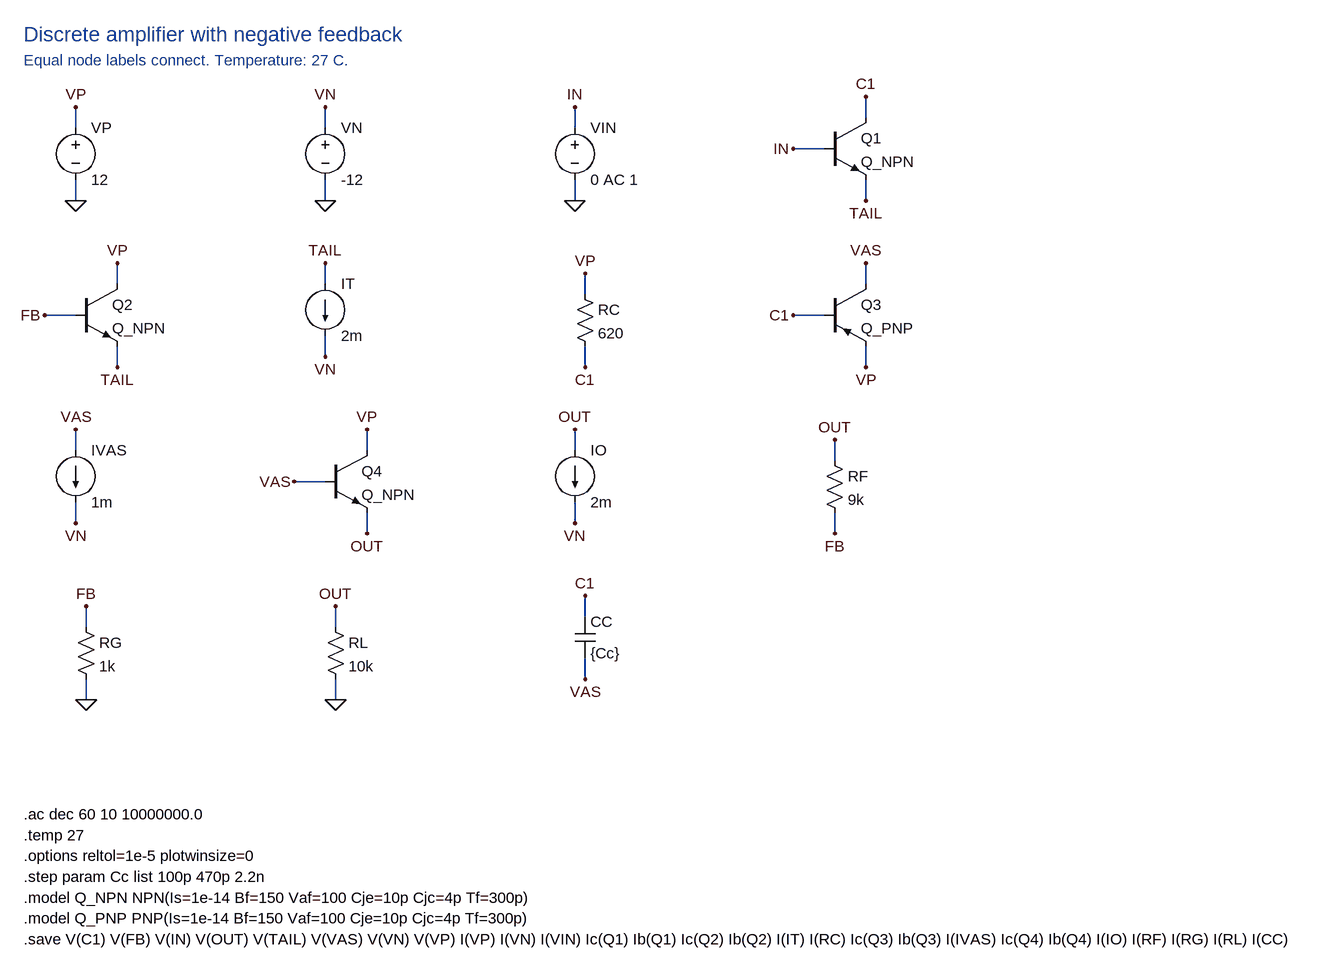
[diagram p0: schematic discrete-feedback-amplifier.asc]
discrete-feedback-amplifier.asc, the LTspice schematic file:
Version 4
SHEET 1 1740 1576
WIRE 144 176 144 144
WIRE 144 256 144 288
WIRE 528 176 528 144
WIRE 528 256 528 288
WIRE 912 176 912 144
WIRE 912 256 912 288
WIRE 1360 160 1360 128
WIRE 1296 208 1248 208
WIRE 1360 256 1360 288
WIRE 208 416 208 384
WIRE 144 464 96 464
WIRE 208 512 208 544
WIRE 528 416 528 384
WIRE 528 496 528 528
WIRE 928 432 928 400
WIRE 928 512 928 544
WIRE 1360 416 1360 384
WIRE 1296 464 1248 464
WIRE 1360 512 1360 544
WIRE 144 672 144 640
WIRE 144 752 144 784
WIRE 592 672 592 640
WIRE 528 720 480 720
WIRE 592 768 592 800
WIRE 912 672 912 640
WIRE 912 752 912 784
WIRE 1312 688 1312 656
WIRE 1312 768 1312 800
WIRE 160 944 160 912
WIRE 160 1024 160 1056
WIRE 544 944 544 912
WIRE 544 1024 544 1056
WIRE 928 928 928 896
WIRE 928 992 928 1024
FLAG 144 144 VP
FLAG 144 288 0
FLAG 528 144 VN
FLAG 528 288 0
FLAG 912 144 IN
FLAG 912 288 0
FLAG 1360 128 C1
FLAG 1248 208 IN
FLAG 1360 288 TAIL
FLAG 208 384 VP
FLAG 96 464 FB
FLAG 208 544 TAIL
FLAG 528 384 TAIL
FLAG 528 528 VN
FLAG 928 400 VP
FLAG 928 544 C1
FLAG 1360 384 VAS
FLAG 1248 464 C1
FLAG 1360 544 VP
FLAG 144 640 VAS
FLAG 144 784 VN
FLAG 592 640 VP
FLAG 480 720 VAS
FLAG 592 800 OUT
FLAG 912 640 OUT
FLAG 912 784 VN
FLAG 1312 656 OUT
FLAG 1312 800 FB
FLAG 160 912 FB
FLAG 160 1056 0
FLAG 544 912 OUT
FLAG 544 1056 0
FLAG 928 896 C1
FLAG 928 1024 VAS
SYMBOL voltage 144 160 R0
SYMATTR InstName VP
SYMATTR Value 12
SYMBOL voltage 528 160 R0
SYMATTR InstName VN
SYMATTR Value -12
SYMBOL voltage 912 160 R0
SYMATTR InstName VIN
SYMATTR Value 0 AC 1
SYMBOL npn 1296 160 R0
SYMATTR InstName Q1
SYMATTR Value Q_NPN
SYMBOL npn 144 416 R0
SYMATTR InstName Q2
SYMATTR Value Q_NPN
SYMBOL current 528 416 R0
SYMATTR InstName IT
SYMATTR Value 2m
SYMBOL res 912 416 R0
SYMATTR InstName RC
SYMATTR Value 620
SYMBOL pnp 1296 416 R0
SYMATTR InstName Q3
SYMATTR Value Q_PNP
SYMBOL current 144 672 R0
SYMATTR InstName IVAS
SYMATTR Value 1m
SYMBOL npn 528 672 R0
SYMATTR InstName Q4
SYMATTR Value Q_NPN
SYMBOL current 912 672 R0
SYMATTR InstName IO
SYMATTR Value 2m
SYMBOL res 1296 672 R0
SYMATTR InstName RF
SYMATTR Value 9k
SYMBOL res 144 928 R0
SYMATTR InstName RG
SYMATTR Value 1k
SYMBOL res 528 928 R0
SYMATTR InstName RL
SYMATTR Value 10k
SYMBOL cap 912 928 R0
SYMATTR InstName CC
SYMATTR Value {Cc}
TEXT 64 32 Left 3 ;Discrete amplifier with negative feedback
TEXT 64 72 Left 2 ;Equal node labels connect. Temperature: 27 C.
TEXT 64 1232 Left 2 !.ac dec 60 10 10000000.0
TEXT 64 1264 Left 2 !.temp 27
TEXT 64 1296 Left 2 !.options reltol=1e-5 plotwinsize=0
TEXT 64 1328 Left 2 !.step param Cc list 100p 470p 2.2n
TEXT 64 1360 Left 2 !.model Q_NPN NPN(Is=1e-14 Bf=150 Vaf=100 Cje=10p Cjc=4p Tf=300p)
TEXT 64 1392 Left 2 !.model Q_PNP PNP(Is=1e-14 Bf=150 Vaf=100 Cje=10p Cjc=4p Tf=300p)
TEXT 64 1424 Left 2 !.save V(C1) V(FB) V(IN) V(OUT) V(TAIL) V(VAS) V(VN) V(VP) I(VP) I(VN) I(VIN) Ic(Q1) Ib(Q1) Ic(Q2) Ib(Q2) I(IT) I(RC) Ic(Q3) Ib(Q3) I(IVAS) Ic(Q4) Ib(Q4) I(IO) I(RF) I(RG) I(RL) I(CC)

The netlist it stands for:
* discrete-feedback-amplifier.asc
VP VP 0 12
VN VN 0 -12
VIN IN 0 0 AC 1
Q1 C1 IN TAIL 0 Q_NPN
Q2 VP FB TAIL 0 Q_NPN
IT TAIL VN 2m
RC VP C1 620
Q3 VAS C1 VP 0 Q_PNP
IVAS VAS VN 1m
Q4 VP VAS OUT 0 Q_NPN
IO OUT VN 2m
RF OUT FB 9k
RG FB 0 1k
RL OUT 0 10k
CC C1 VAS {Cc}
.model NPN NPN
.model PNP PNP
.lib standard.bjt
* Discrete amplifier with negative feedback
* Equal node labels connect. Temperature: 27 C.
.ac dec 60 10 10000000.0
.temp 27
.options reltol=1e-5 plotwinsize=0
.step param Cc list 100p 470p 2.2n
.model Q_NPN NPN(Is=1e-14 Bf=150 Vaf=100 Cje=10p Cjc=4p Tf=300p)
.model Q_PNP PNP(Is=1e-14 Bf=150 Vaf=100 Cje=10p Cjc=4p Tf=300p)
.save V(C1) V(FB) V(IN) V(OUT) V(TAIL) V(VAS) V(VN) V(VP) I(VP) I(VN) I(VIN) Ic(Q1) Ib(Q1) Ic(Q2) Ib(Q2) I(IT) I(RC) Ic(Q3) Ib(Q3) I(IVAS) Ic(Q4) Ib(Q4) I(IO) I(RF) I(RG) I(RL) I(CC)
.backanno
.end